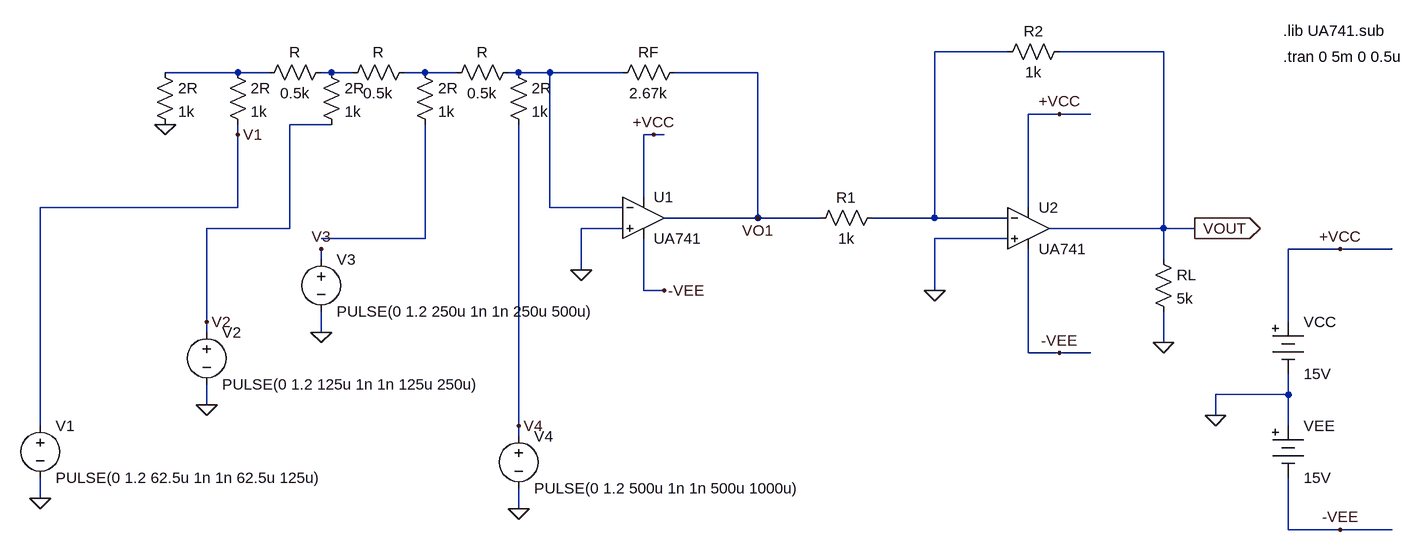
[diagram p0: schematic Lab2-1.asc]
Lab2-1.asc, the LTspice schematic file:
Version 4
SHEET 1 1628 740
WIRE 960 -64 848 -64
WIRE 1200 -64 1040 -64
WIRE -224 -32 -336 -32
WIRE -176 -32 -224 -32
WIRE -80 -32 -96 -32
WIRE -48 -32 -80 -32
WIRE 64 -32 32 -32
WIRE 112 -32 64 -32
WIRE 208 -32 192 -32
WIRE 256 -32 208 -32
WIRE 368 -32 256 -32
WIRE 576 -32 448 -32
WIRE 1040 32 992 32
WIRE 1088 32 1040 32
WIRE -80 48 -144 48
WIRE -224 64 -224 48
WIRE 416 64 400 64
WIRE 432 64 416 64
WIRE 400 160 400 64
WIRE -224 176 -224 64
WIRE -224 176 -528 176
WIRE 256 176 256 -32
WIRE 368 176 256 176
WIRE 992 176 992 32
WIRE 576 192 576 -32
WIRE 576 192 432 192
WIRE 672 192 576 192
WIRE 848 192 848 -64
WIRE 848 192 752 192
WIRE 960 192 848 192
WIRE -144 208 -144 48
WIRE -144 208 -272 208
WIRE 368 208 304 208
WIRE 1200 208 1200 -64
WIRE 1200 208 1024 208
WIRE 1248 208 1200 208
WIRE 64 224 64 48
WIRE 64 224 -96 224
WIRE 960 224 848 224
WIRE 1472 240 1392 240
WIRE 1552 240 1472 240
WIRE -96 256 -96 240
WIRE 1200 256 1200 208
WIRE 304 272 304 208
WIRE 400 304 400 224
WIRE 432 304 400 304
WIRE 848 304 848 224
WIRE -272 352 -272 208
WIRE 1392 352 1392 240
WIRE -272 368 -272 352
WIRE -96 368 -96 336
WIRE 1200 384 1200 336
WIRE 992 400 992 240
WIRE 1040 400 992 400
WIRE 1088 400 1040 400
WIRE 1392 464 1392 432
WIRE 1392 464 1280 464
WIRE -272 480 -272 448
WIRE 1280 496 1280 464
WIRE -528 512 -528 176
WIRE 208 512 208 48
WIRE 1392 512 1392 464
WIRE 208 528 208 512
WIRE -528 624 -528 592
WIRE 208 640 208 608
WIRE 1392 672 1392 592
WIRE 1472 672 1392 672
WIRE 1552 672 1472 672
FLAG 1248 208 VOUT
IOPIN 1248 208 Out
FLAG 1280 496 0
FLAG 1472 240 +VCC
FLAG 1040 32 +VCC
FLAG 1472 672 -VEE
FLAG 1040 400 -VEE
FLAG 1200 384 0
FLAG 848 304 0
FLAG 416 64 +VCC
FLAG 432 304 -VEE
FLAG 576 192 VO1
FLAG 304 272 0
FLAG -336 48 0
FLAG -528 624 0
FLAG -272 480 0
FLAG -96 368 0
FLAG 208 640 0
FLAG -272 352 V2
FLAG 208 512 V4
FLAG -96 240 V3
FLAG -224 64 V1
SYMBOL Opamps\\opamp2 992 144 R0
SYMATTR InstName U2
SYMATTR Value UA741
SYMBOL res 1184 240 R0
SYMATTR InstName RL
SYMATTR Value 5k
SYMBOL Misc\\battery 1392 336 R0
SYMATTR InstName VCC
SYMATTR Value 15V
SYMBOL Misc\\battery 1392 496 R0
SYMATTR InstName VEE
SYMATTR Value 15V
SYMBOL res 768 176 R90
WINDOW 0 0 56 VBottom 2
WINDOW 3 32 56 VTop 2
SYMATTR InstName R1
SYMATTR Value 1k
SYMBOL res 1056 -80 R90
WINDOW 0 0 56 VBottom 2
WINDOW 3 32 56 VTop 2
SYMATTR InstName R2
SYMATTR Value 1k
SYMBOL Opamps\\opamp2 400 128 R0
SYMATTR InstName U1
SYMATTR Value UA741
SYMBOL res 464 -48 R90
WINDOW 0 0 56 VBottom 2
WINDOW 3 32 56 VTop 2
SYMATTR InstName RF
SYMATTR Value 2.67k
SYMBOL res 192 -48 R0
SYMATTR InstName 2R
SYMATTR Value 1k
SYMBOL res 48 -48 R0
SYMATTR InstName 2R
SYMATTR Value 1k
SYMBOL res -96 -48 R0
SYMATTR InstName 2R
SYMATTR Value 1k
SYMBOL res -352 -48 R0
SYMATTR InstName 2R
SYMATTR Value 1k
SYMBOL res -80 -48 R90
WINDOW 0 0 56 VBottom 2
WINDOW 3 32 56 VTop 2
SYMATTR InstName R
SYMATTR Value 0.5k
SYMBOL res 48 -48 R90
WINDOW 0 0 56 VBottom 2
WINDOW 3 32 56 VTop 2
SYMATTR InstName R
SYMATTR Value 0.5k
SYMBOL res 208 -48 R90
WINDOW 0 0 56 VBottom 2
WINDOW 3 32 56 VTop 2
SYMATTR InstName R
SYMATTR Value 0.5k
SYMBOL res -240 -48 R0
SYMATTR InstName 2R
SYMATTR Value 1k
SYMBOL voltage -528 496 R0
WINDOW 123 0 0 Left 2
WINDOW 39 0 0 Left 2
SYMATTR InstName V1
SYMATTR Value PULSE(0 1.2 62.5u 1n 1n 62.5u 125u)
SYMBOL voltage -272 352 R0
WINDOW 123 0 0 Left 2
WINDOW 39 0 0 Left 2
SYMATTR InstName V2
SYMATTR Value PULSE(0 1.2 125u 1n 1n 125u 250u)
SYMBOL voltage -96 240 R0
WINDOW 123 0 0 Left 2
WINDOW 39 0 0 Left 2
SYMATTR InstName V3
SYMATTR Value PULSE(0 1.2 250u 1n 1n 250u 500u)
SYMBOL voltage 208 512 R0
WINDOW 123 0 0 Left 2
WINDOW 39 0 0 Left 2
SYMATTR InstName V4
SYMATTR Value PULSE(0 1.2 500u 1n 1n 500u 1000u)
TEXT 1384 -96 Left 2 !.lib UA741.sub
TEXT 1384 -56 Left 2 !.tran 0 5m 0 0.5u

The netlist it stands for:
* Lab2-1.asc
XU2 0 N001 +VCC -VEE VOUT UA741  ; pins In+ In- V+ V- OUT
RL VOUT 0 5k
VCC +VCC 0 15V
VEE 0 -VEE 15V
R1 N001 VO1 1k
R2 VOUT N001 1k
XU1 0 N005 +VCC -VEE VO1 UA741  ; pins In+ In- V+ V- OUT
RF VO1 N005 2.67k
R§2R N005 V4 1k
R§2R N004 N006 1k
R§2R N003 V2 1k
R§2R N002 0 1k
R N003 N002 0.5k
R N004 N003 0.5k
R N005 N004 0.5k
R§2R N002 V1 1k
V1 V1 0 PULSE(0 1.2 62.5u 1n 1n 62.5u 125u)
V2 V2 0 PULSE(0 1.2 125u 1n 1n 125u 250u)
V3 V3 0 PULSE(0 1.2 250u 1n 1n 250u 500u)
V4 V4 0 PULSE(0 1.2 500u 1n 1n 500u 1000u)
.lib UA741.sub
.tran 0 5m 0 0.5u
.backanno
.end